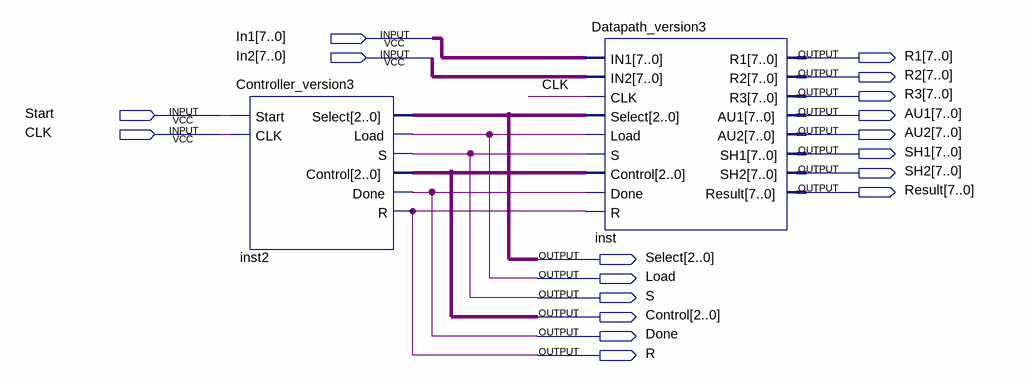
[diagram p0: schematic sheet]
// Quartus schematic version3.bdf as structural Verilog: 2 symbols, 18 pins
module version3 (
  input  [7:0] In1,
  input  [7:0] In2,
  input  Start,
  input  CLK,
  output [7:0] R1,
  output [7:0] R2,
  output [7:0] R3,
  output [7:0] AU1,
  output [7:0] AU2,
  output [7:0] SH1,
  output [7:0] SH2,
  output [7:0] Result,
  output [2:0] Select,
  output Load,
  output S,
  output [2:0] Control,
  output Done,
  output R
);

  Controller_version3 inst2 (
    .Start(Start), .CLK(CLK), .Select(Select), .Load(Load), .S(S), .Control(Control), .Done(Done), .R(R));
  Datapath_version3 inst (
    .IN1(In1), .IN2(In2), .CLK(CLK), .Select(Select), .Load(Load), .S(S), .Control(Control), .Done(Done),
    .R(R), .R1(R1), .R2(R2), .R3(R3), .AU1(AU1), .AU2(AU2), .SH1(SH1), .SH2(SH2), .Result(Result));
endmodule
